# Altium schematic sheet clocking.SchDoc
size A4
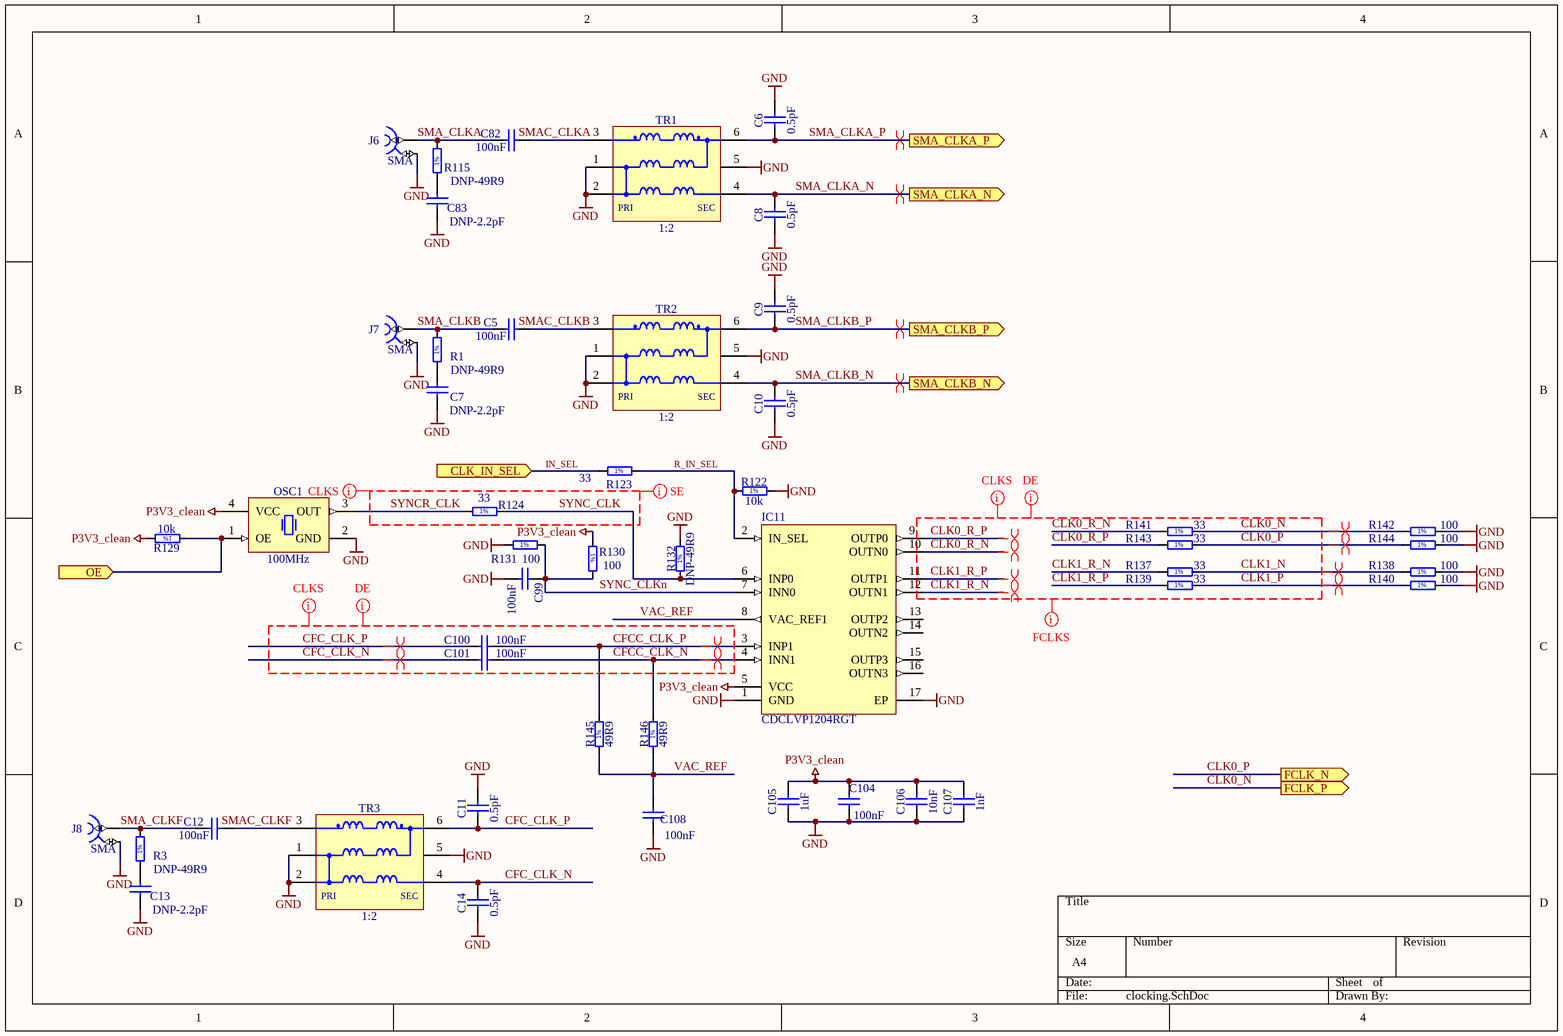
[diagram p0: clocking.SchDoc]

## Parts
C5  100nF  [CAPC1005X55N]
C6  0.5pF  [CAPC1005X50N]
C7  DNP-2.2pF  [CAPC1005X55N]
C8  0.5pF  [CAPC1005X50N]
C9  0.5pF  [CAPC1005X50N]
C10  0.5pF  [CAPC1005X50N]
C11  0.5pF  [CAPC1005X50N]
C12  100nF  [CAPC1005X55N]
C13  DNP-2.2pF  [CAPC1005X55N]
C14  0.5pF  [CAPC1005X50N]
C82  100nF  [CAPC1005X55N]
C83  DNP-2.2pF  [CAPC1005X55N]
C99  100nF  [CAPC0603X33N]
C100  100nF  [CAPC0603X33N]
C101  100nF  [CAPC0603X33N]
C104  100nF  [CAPC0603X33N]
C105  1uF  [CAPC1608X87N]
C106  10nF  [CAPC0603X33N]
C107  1nF  [CAPC0603X33N]
C108  100nF  [CAPC1005X55N]
IC11  CDCLVP1204RGT  [QFN50P300X300X100-17N-S165]
J6  SMA  [HUBER-SUHNER_85_SMA-50-0-101/111_NE]
J7  SMA  [HUBER-SUHNER_85_SMA-50-0-101/111_NE]
J8  SMA  [HUBER-SUHNER_85_SMA-50-0-101/111_NE]
OSC1  100MHz  [OSC_EPSON_SG-8002CA]
R1  DNP-49R9  [RESC1005X40N]
R3  DNP-49R9  [RESC1005X40N]
R115  DNP-49R9  [RESC1005X40N]
R122  10k  [RESC1005X40N]
R123  33  [RESC1005X40N]
R124  33  [RESC1005X40N]
R129  10k  [RESC1005X40N]
R130  100  [RESC1005X40N]
R131  100  [RESC1005X40N]
R132  DNP-49R9  [RESC1005X40N]
R137  33  [RESC1005X40N]
R138  100  [RESC1005X40N]
R139  33  [RESC1005X40N]
R140  100  [RESC1005X40N]
R141  33  [RESC1005X40N]
R142  100  [RESC1005X40N]
R143  33  [RESC1005X40N]
R144  100  [RESC1005X40N]
R145  49R9  [RESC1005X40N]
R146  49R9  [RESC1005X40N]
TR1  1:2  [XFMR_MINI-CIRCUITS_DB1627]
TR2  1:2  [XFMR_MINI-CIRCUITS_DB1627]
TR3  1:2  [XFMR_MINI-CIRCUITS_DB1627]

## Ports
CLK_IN_SEL (in), FCLK_N (out), FCLK_P (out), OE (in), SMA_CLKA_N (out), SMA_CLKA_P (out), SMA_CLKB_N (out), SMA_CLKB_P (out)

## Nets
GND: C6.2 C7.2 C8.1 C9.2 C10.1 C11.2 C13.2 C14.1 C83.2 C99.1 C104.1 C105.1 C106.1 C107.1 C108.1 IC11.1(GND) IC11.17(EP) J6.2 J7.2 J8.2 OSC1.2(GND) R122.2 R131.1 R132.2 R138.2 R140.2 R142.2 R144.2 TR1.1(P1) TR1.2(P1) TR1.5(NC) TR2.1(P1) TR2.2(P1) TR2.5(NC) TR3.1(P1) TR3.2(P1) TR3.5(NC)
P3V3_clean: C104.2 C105.2 C106.2 C107.2 IC11.5(VCC) OSC1.4(VCC) R129.2 R130.1
CFC_CLK_N: C14.2 C101.2 TR3.4(S1)
CFC_CLK_P: C11.1 C100.2 TR3.6(S1)
CFCC_CLK_N: C101.1 IC11.4(INN1) R146.2
CFCC_CLK_P: C100.1 IC11.3(INP1) R145.2
CLK0_N: R141.2 R142.1 ; port FCLK_P
CLK0_P: R143.2 R144.1 ; port FCLK_N
CLK0_R_N: IC11.10(OUTN0) R141.1
CLK0_R_P: IC11.9(OUTP0) R143.1
CLK1_N: R137.2 R138.1
CLK1_P: R139.2 R140.1
CLK1_R_N: IC11.12(OUTN1) R137.1
CLK1_R_P: IC11.11(OUTP1) R139.1
IN_SEL: R123.1 ; port CLK_IN_SEL
OE: OSC1.1(OE) R129.1 ; port OE
R_IN_SEL: IC11.2(IN_SEL) R122.1 R123.2
SMA_CLKA: C82.2 J6.1 R115.2
SMA_CLKA_N: C8.2 TR1.4(S1) ; port SMA_CLKA_N
SMA_CLKA_P: C6.1 TR1.6(S1) ; port SMA_CLKA_P
SMA_CLKB: C5.2 J7.1 R1.2
SMA_CLKB_N: C10.2 TR2.4(S1) ; port SMA_CLKB_N
SMA_CLKB_P: C9.1 TR2.6(S1) ; port SMA_CLKB_P
SMA_CLKF: C12.2 J8.1 R3.2
SYNC_CLK: IC11.6(INP0) R124.2 R132.1
SYNC_CLKn: C99.2 IC11.7(INN0) R130.2 R131.2
SYNCR_CLK: OSC1.3(OUT) R124.1
VAC_REF: C108.2 IC11.8(VAC_REF1) R145.1 R146.1
NetC5_1: C5.1 TR2.3(P1)
NetC7_1: C7.1 R1.1
NetC12_1: C12.1 TR3.3(P1)
NetC13_1: C13.1 R3.1
NetC82_1: C82.1 TR1.3(P1)
NetC83_1: C83.1 R115.1

Not connected (* = marked no-connect by the designer): IC11 13(OUTP2) 14(OUTN2) 15(OUTP3) 16(OUTN3)

## Layout directives
differential pair: CFC_CLK_N, CFC_CLK_P, CFCC_CLK_N, CFCC_CLK_P, CLK0_N, CLK0_P, CLK0_R_N, CLK0_R_P, CLK1_N, CLK1_P, CLK1_R_N, CLK1_R_P, SMA_CLKA_N, SMA_CLKA_P, SMA_CLKB_N, SMA_CLKB_P
net class CLKS: CFC_CLK_N, CFC_CLK_P, CFCC_CLK_N, CFCC_CLK_P, CLK0_N, CLK0_P, CLK0_R_N, CLK0_R_P, CLK1_N, CLK1_P, CLK1_R_N, CLK1_R_P, SYNC_CLK, SYNCR_CLK
net class SE: SYNC_CLK, SYNCR_CLK
net class FCLKS: CLK0_N, CLK0_P, CLK0_R_N, CLK0_R_P, CLK1_N, CLK1_P, CLK1_R_N, CLK1_R_P
net class DE: CFC_CLK_N, CFC_CLK_P, CFCC_CLK_N, CFCC_CLK_P, CLK0_N, CLK0_P, CLK0_R_N, CLK0_R_P, CLK1_N, CLK1_P, CLK1_R_N, CLK1_R_P

## Notes on the sheet
- Labels drawn without touching a wire or pin: SMAC_CLKA, SMAC_CLKB, SMAC_CLKF
- (in symbol R0402_10K_1%_0.0625W_100PPM) 1%
- (in symbol R0402_33R_1%_0.0625W_100PPM) 1%
- (in symbol R0402_49R9_1%_0.0625W_100PPM) 1%
- (in symbol R0402_100R_1%_0.0625W_100PPM) 1%
- (in symbol XFMR_MINI-CIRCUITS_TCM2-43X+) PRI; SEC

## Library data of the parts
C5 C12 C82 C108 = CC0402_100NF_16V_10%_X5R: Non-polarised capacitor; Part Description: SMD Multilayer Chip Ceramic Capacitor; Manufacturer: GENERIC; Manufacturer1 Part Number: GRM155R61C104KA88D; Voltage: 16V; TC: X5R; Tolerance: ±10%; Table: Capacitors SMD; Part Number: CC0402_100NF_16V_10%_X5R; Component Kind: Standard; Component Type: Standard; Pin Count: 2; Value: 100nF; Status: None; Manufacturer Part Number: CC0402_100NF_16V_10%_X5R; Case: 0402; Mounted: Yes; Socket: No; SMD: Yes; Manufacturer1 Example: MURATA; Manufacturer1 ComponentHeight: 0.55mm; HelpURL: \\cern.ch\dfs\Applications\Altium\Datasheets\CC0402_X5R_MURATA_GRM.pdf; Author: CERN DEM JLC; CreateDate: 2013-12-10; LatestRevisionDate: 2013-12-10
C6 C8-C11 C14 = CC0402_0.5PF_25V_0.05PF_AVX_04023J0R5ABSTR: Non-polarised capacitor; Part Description: Thin-Film Chip Capacitors for RF Signal and Power Applications, Accu-P Series; Manufacturer: AVX; Voltage: 25V; Tolerance: ±0.05pF; Part Number: CC0402_0.5PF_25V_0.05PF_AVX_04023J0R5ABSTR; Component Kind: Standard; Component Type: Standard; Pin Count: 2; Value: 0.5pF; Status: None; Manufacturer Part Number: 04023J0R5ABSTR; Case: 0402; Mounted: Yes; Socket: No; SMD: Yes; Sense: No; ComponentHeight: 0.5mm; HelpURL: \\cern.ch\dfs\Applications\Altium\Datasheets\CC0402_AVX_ACCU-P.pdf; Author: CERN DEM JLC; CreateDate: 22.02.2017; LatestRevisionDate: 22.02.2017
C7 C13 C83 = CC0402_2.2PF_50V_0.25PF_NP0: Non-polarised capacitor; Part Description: SMD Multilayer Chip Ceramic Capacitor; Manufacturer: GENERIC; Manufacturer1 Part Number: 223886915228; Voltage: 50V; TC: NP0; Tolerance: ±0.25pF; Table: Capacitors SMD; Part Number: CC0402_2.2PF_50V_0.25PF_NP0; Component Kind: Standard; Component Type: Standard; Pin Count: 2; Value: DNP-2.2pF; Status: Not Recommended; Manufacturer Part Number: CC0402_2.2PF_50V_0.25PF_NP0; Case: 0402; Mounted: Yes; Socket: No; SMD: Yes; Manufacturer1 Example: PHYCOMP; Manufacturer1 ComponentHeight: 0.55mm; HelpURL: \\cern.ch\dfs\Applications\Altium\Datasheets\CC0402_NP0_PHYCOMP.pdf; Author: CERN DEM JLC; CreateDate: 2007-12-03; LatestRevisionDate: 2007-12-03
C99-C101 C104 = CC0201_100NF_6.3V_10%_X5R: Non-polarised capacitor; Part Description: SMD Multilayer Chip Ceramic Capacitor; Manufacturer: GENERIC; Manufacturer1 Part Number: 02016D104KAT2A; Voltage: 6.3V; TC: X5R; Tolerance: ±10%; Table: Capacitors SMD; Part Number: CC0201_100NF_6.3V_10%_X5R; Component Kind: Standard; Component Type: Standard; Pin Count: 2; Value: 100nF; Status: Not Recommended; Manufacturer Part Number: CC0201_100NF_6.3V_10%_X5R; Case: 0201; Mounted: Yes; Socket: No; SMD: Yes; Manufacturer1 Example: AVX; Manufacturer1 ComponentHeight: 0.33mm; HelpURL: \\cern.ch\dfs\Applications\Altium\Datasheets\CC0201_X5R_AVX.pdf; Author: CERN DEM JLC; CreateDate: 2007-12-03; LatestRevisionDate: 2007-12-03
C105 = CC0603_1UF_25V_10%_X7R: Non-polarised capacitor; Part Description: SMD Multilayer Chip Ceramic Capacitor; Manufacturer: GENERIC; Manufacturer1 Part Number: GRM188R71E105KA12D; Voltage: 25V; TC: X7R; Tolerance: ±10%; Table: Capacitors SMD; Part Number: CC0603_1UF_25V_10%_X7R; Component Kind: Standard; Component Type: Standard; Pin Count: 2; Value: 1uF; Status: None; Manufacturer Part Number: CC0603_1UF_25V_10%_X7R; Case: 0603; Mounted: Yes; Socket: No; SMD: Yes; Manufacturer1 Example: MURATA; Manufacturer1 ComponentHeight: 0.9mm; HelpURL: \\cern.ch\dfs\Applications\Altium\Datasheets\CC0603_X7R_MURATA.pdf; Author: CERN DEM JLC; CreateDate: 2011-01-18; LatestRevisionDate: 2011-01-18
C106 = CC0201_10NF_10V_10%_X5R: Non-polarised capacitor; Part Description: SMD Multilayer Chip Ceramic Capacitor; Manufacturer: GENERIC; Manufacturer1 Part Number: 0201ZD103KAT2A; Voltage: 10V; TC: X5R; Tolerance: ±10%; Table: Capacitors SMD; Part Number: CC0201_10NF_10V_10%_X5R; Component Kind: Standard; Component Type: Standard; Pin Count: 2; Value: 10nF; Status: Not Recommended; Manufacturer Part Number: CC0201_10NF_10V_10%_X5R; Case: 0201; Mounted: Yes; Socket: No; SMD: Yes; Manufacturer1 Example: AVX; Manufacturer1 ComponentHeight: 0.33mm; HelpURL: \\cern.ch\dfs\Applications\Altium\Datasheets\CC0201_X5R_AVX.pdf; Author: CERN DEM JLC; CreateDate: 2007-12-03; LatestRevisionDate: 2007-12-03
C107 = CC0201_1NF_16V_10%_X5R: Non-polarised capacitor; Part Description: SMD Multilayer Chip Ceramic Capacitor; Manufacturer: GENERIC; Manufacturer1 Part Number: 0201YD102KAT2A; Voltage: 16V; TC: X5R; Tolerance: ±10%; Table: Capacitors SMD; Part Number: CC0201_1NF_16V_10%_X5R; Component Kind: Standard; Component Type: Standard; Pin Count: 2; Value: 1nF; Status: Not Recommended; Manufacturer Part Number: CC0201_1NF_16V_10%_X5R; Case: 0201; Mounted: Yes; Socket: No; SMD: Yes; Manufacturer1 Example: AVX; Manufacturer1 ComponentHeight: 0.33mm; HelpURL: \\cern.ch\dfs\Applications\Altium\Datasheets\CC0201_X5R_AVX.pdf; Author: CERN DEM JLC; CreateDate: 2007-12-03; LatestRevisionDate: 2007-12-03
IC11 = CDCLVP1204RGT: 2:2 Low Additive Jitter LVPECL Buffer
J6-J8 = HUBER-SUHNER_85_SMA-50-0-101/111_NE: Part Description: SMA 50 Ohms Right Angle PCB Jack; Manufacturer: HUBER+SUHNER; PressFit: No; Part Number: HUBER-SUHNER_85_SMA-50-0-101/111_NE; Component Kind: Standard; Component Type: Standard; Footprint: HUBER-SUHNER_85 SMA-50-0-101/111_NE; Pin Count: 2; Family: SMA; Mounted: Yes; Socket: No; SMD: No; Sense: No; Status: None; Manufacturer Part Number: 85_SMA-50-0-101/111_NE; ComponentHeight: 9.6mm; HelpURL: \\cern.ch\dfs\Applications\Altium\Datasheets\HUBER-SUHNER_85_SMA-50-0-101-111_NE.pdf; Author: CERN DEM JLC; CreateDate: 20.04.2010; LatestRevisionDate: 06.11.2014
OSC1 = OSC_100MHZ_EPSON_SG-8002CAPCB100MHZ: Oscillator 4 pins 1=OE 2=GND 3=OUT 4=VCC; Part Description: 3.3V ±50ppm 15pF -40..85°C, Output Enable Function , Surface Mount Crystal Oscillator (SG-8002CA Serie); Manufacturer: EPSON-TOYOCOM; Table: Crystals & Oscillators; Part Number: OSC_100MHZ_EPSON_SG-8002CAPCB100MHZ; Component Kind: Standard; Component Type: Standard; PackageDescription: SMD Oscillator, Side Convave, 4 pins, 5.00x7.00mm SG-8002CA Serie; Value: 100MHz; Manufacturer Part Number: SG-8002CA PCB 100MHZ; Pin Count: 4; Mounted: Yes; Socket: No; SMD: Yes; ComponentHeight: 1.5mm; HelpURL: \\cern.ch\dfs\Applications\Altium\Datasheets\OSC_EPSON_SG-8002CA.pdf; Author: CERN DEM JLC; CreateDate: 2011-05-02; LatestRevisionDate: 2011-05-02
R1 R3 R115 R132 R145 R146 = R0402_49R9_1%_0.0625W_100PPM: Resistor - 1%; Part Description: General Purpose Thick Film Chip Resistor; Manufacturer: GENERIC; Manufacturer1 Part Number: 232270674999L or RC0402FR-0749R9L; TC: ±100ppm/°C; Table: Resistors SMD; Part Number: R0402_49R9_1%_0.0625W_100PPM; Component Kind: Standard; Component Type: Standard; Pin Count: 2; Status: Not recommended; Power: 0.0625W; Tolerance: ±1%; Manufacturer Part Number: R0402_49R9_1%_0.0625W_100PPM; Case: 0402; Mounted: Yes; Socket: No; SMD: Yes; Manufacturer1 Example: YAGEO PHYCOMP; Manufacturer1 ComponentHeight: 0.4mm; HelpURL: \\cern.ch\dfs\Applications\Altium\Datasheets\R0402_Phycomp_RC0402.pdf; Author: CERN DEM JLC; CreateDate: 2012-10-24; LatestRevisionDate: 2012-10-24
  R1 R3 R115 R132: Value: DNP-49R9
  R145 R146: Value: 49R9
R122 R129 = R0402_10K_1%_0.0625W_100PPM: Resistor - 1%; Part Description: General Purpose Thick Film Chip Resistor; Manufacturer: GENERIC; Manufacturer1 Part Number: 232270671003L; TC: ±100ppm/°C; Table: Resistors SMD; Part Number: R0402_10K_1%_0.0625W_100PPM; Component Kind: Standard; Component Type: Standard; Pin Count: 2; Value: 10k; Status: Not recommended; Power: 0.0625W; Tolerance: ±1%; Manufacturer Part Number: R0402_10K_1%_0.0625W_100PPM; Case: 0402; Mounted: Yes; Socket: No; SMD: Yes; Manufacturer1 Example: YAGEO PHYCOMP; Manufacturer1 ComponentHeight: 0.4mm; HelpURL: \\cern.ch\dfs\Applications\Altium\Datasheets\R0402_Phycomp_RC0402.pdf; Author: CERN DEM JLC; CreateDate: 2007-12-03; LatestRevisionDate: 2012-10-17
R123 R124 R137 R139 R141 R143 = R0402_33R_1%_0.0625W_100PPM: Resistor - 1%; Part Description: General Purpose Thick Film Chip Resistor; Manufacturer: GENERIC; Manufacturer1 Part Number: 232270673309L; TC: ±100ppm/°C; Table: Resistors SMD; Part Number: R0402_33R_1%_0.0625W_100PPM; Component Kind: Standard; Component Type: Standard; Pin Count: 2; Value: 33; Status: Not recommended; Power: 0.0625W; Tolerance: ±1%; Manufacturer Part Number: R0402_33R_1%_0.0625W_100PPM; Case: 0402; Mounted: Yes; Socket: No; SMD: Yes; Manufacturer1 Example: YAGEO PHYCOMP; Manufacturer1 ComponentHeight: 0.4mm; HelpURL: \\cern.ch\dfs\Applications\Altium\Datasheets\R0402_Phycomp_RC0402.pdf; Author: CERN DEM JLC; CreateDate: 2007-12-03; LatestRevisionDate: 2012-10-17
R130 R131 R138 R140 R142 R144 = R0402_100R_1%_0.0625W_100PPM: Resistor - 1%; Part Description: General Purpose Thick Film Chip Resistor; Manufacturer: GENERIC; Manufacturer1 Part Number: 232270671001L; TC: ±100ppm/°C; Table: Resistors SMD; Part Number: R0402_100R_1%_0.0625W_100PPM; Component Kind: Standard; Component Type: Standard; Pin Count: 2; Value: 100; Status: Not recommended; Power: 0.0625W; Tolerance: ±1%; Manufacturer Part Number: R0402_100R_1%_0.0625W_100PPM; Case: 0402; Mounted: Yes; Socket: No; SMD: Yes; Manufacturer1 Example: YAGEO PHYCOMP; Manufacturer1 ComponentHeight: 0.4mm; HelpURL: \\cern.ch\dfs\Applications\Altium\Datasheets\R0402_Phycomp_RC0402.pdf; Author: CERN DEM JLC; CreateDate: 2007-12-03; LatestRevisionDate: 2012-10-17
TR1-TR3 = XFMR_MINI-CIRCUITS_TCM2-43X+: 50 OHMS 10 to 4000 MHz RF Transformer; Power: 0.4W; Part Number: XFMR_MINI-CIRCUITS_TCM2-43X+; Component Kind: Standard; Component Type: Standard; Pin Count: 6; Value: 1:2; Status: None; Part Description: 50 Ohms 10 to 4000MHz RF Transformer; Manufacturer: MINI-CIRCUITS; Manufacturer Part Number: TCM2-43X+; Mounted: Yes; Socket: No; Sense: No; SMD: Yes; ComponentHeight: 4.06mm; HelpURL: \\cern.ch\dfs\Applications\Altium\Datasheets\XFMR_MINI-CIRCUITS_TCM2-43X+.pdf; Author: CERN DEM BC; CreateDate: 12.02.2016; LatestRevisionDate: 12.02.2016